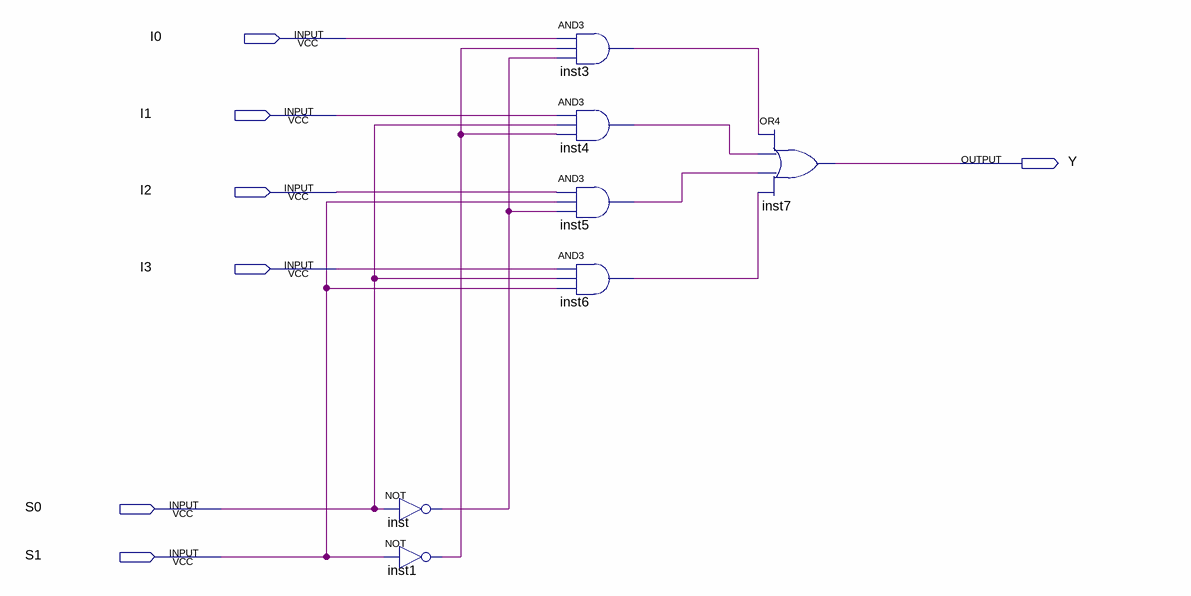
[diagram p0: schematic sheet]
// Quartus schematic Multiplexer4to1.bdf as structural Verilog: 7 symbols, 7 pins
module Multiplexer4to1 (
  input  I0,
  input  I1,
  input  I2,
  input  I3,
  input  S0,
  input  S1,
  output Y
);

  wire inst1_out, inst3_out, inst4_out, inst5_out, inst6_out, inst_out;

  not inst (inst_out, S0);
  not inst1 (inst1_out, S1);
  and inst3 (inst3_out, I0, inst1_out, inst_out);
  and inst4 (inst4_out, I1, S0, inst1_out);
  and inst5 (inst5_out, I2, S1, inst_out);
  and inst6 (inst6_out, I3, S0, S1);
  or inst7 (Y, inst3_out, inst4_out, inst5_out, inst6_out);
endmodule
